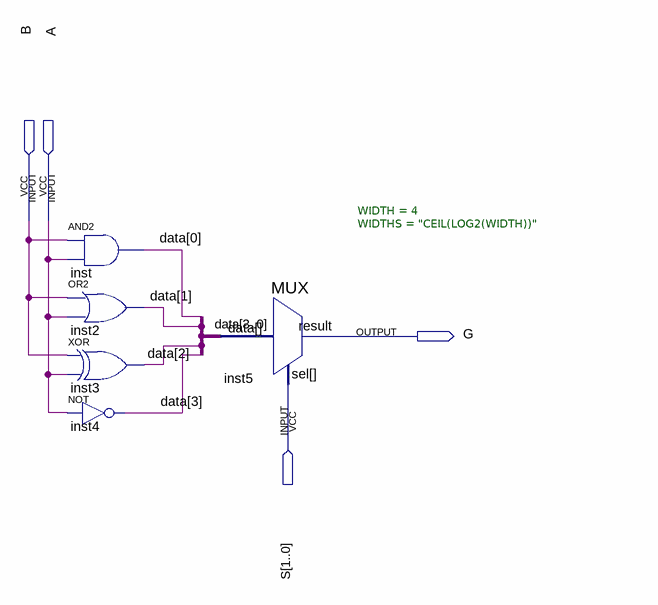
[diagram p0: schematic sheet]
// Quartus schematic Logic.bdf as structural Verilog: 5 symbols, 4 pins
module Logic (
  input  B,
  input  A,
  input  [1:0] S,
  output G
);

  wire [3:0] data;

  and inst (data[0], B, A);
  or inst2 (data[1], B, A);
  xor inst3 (data[2], B, A);
  not inst4 (data[3], A);
  MUX #(.WIDTH(4), .WIDTHS("CEIL(LOG2(WIDTH))")) inst5 (.data(data), .sel(S), .result(G));
endmodule
